# Altium schematic sheet STM32.SchDoc
size A3
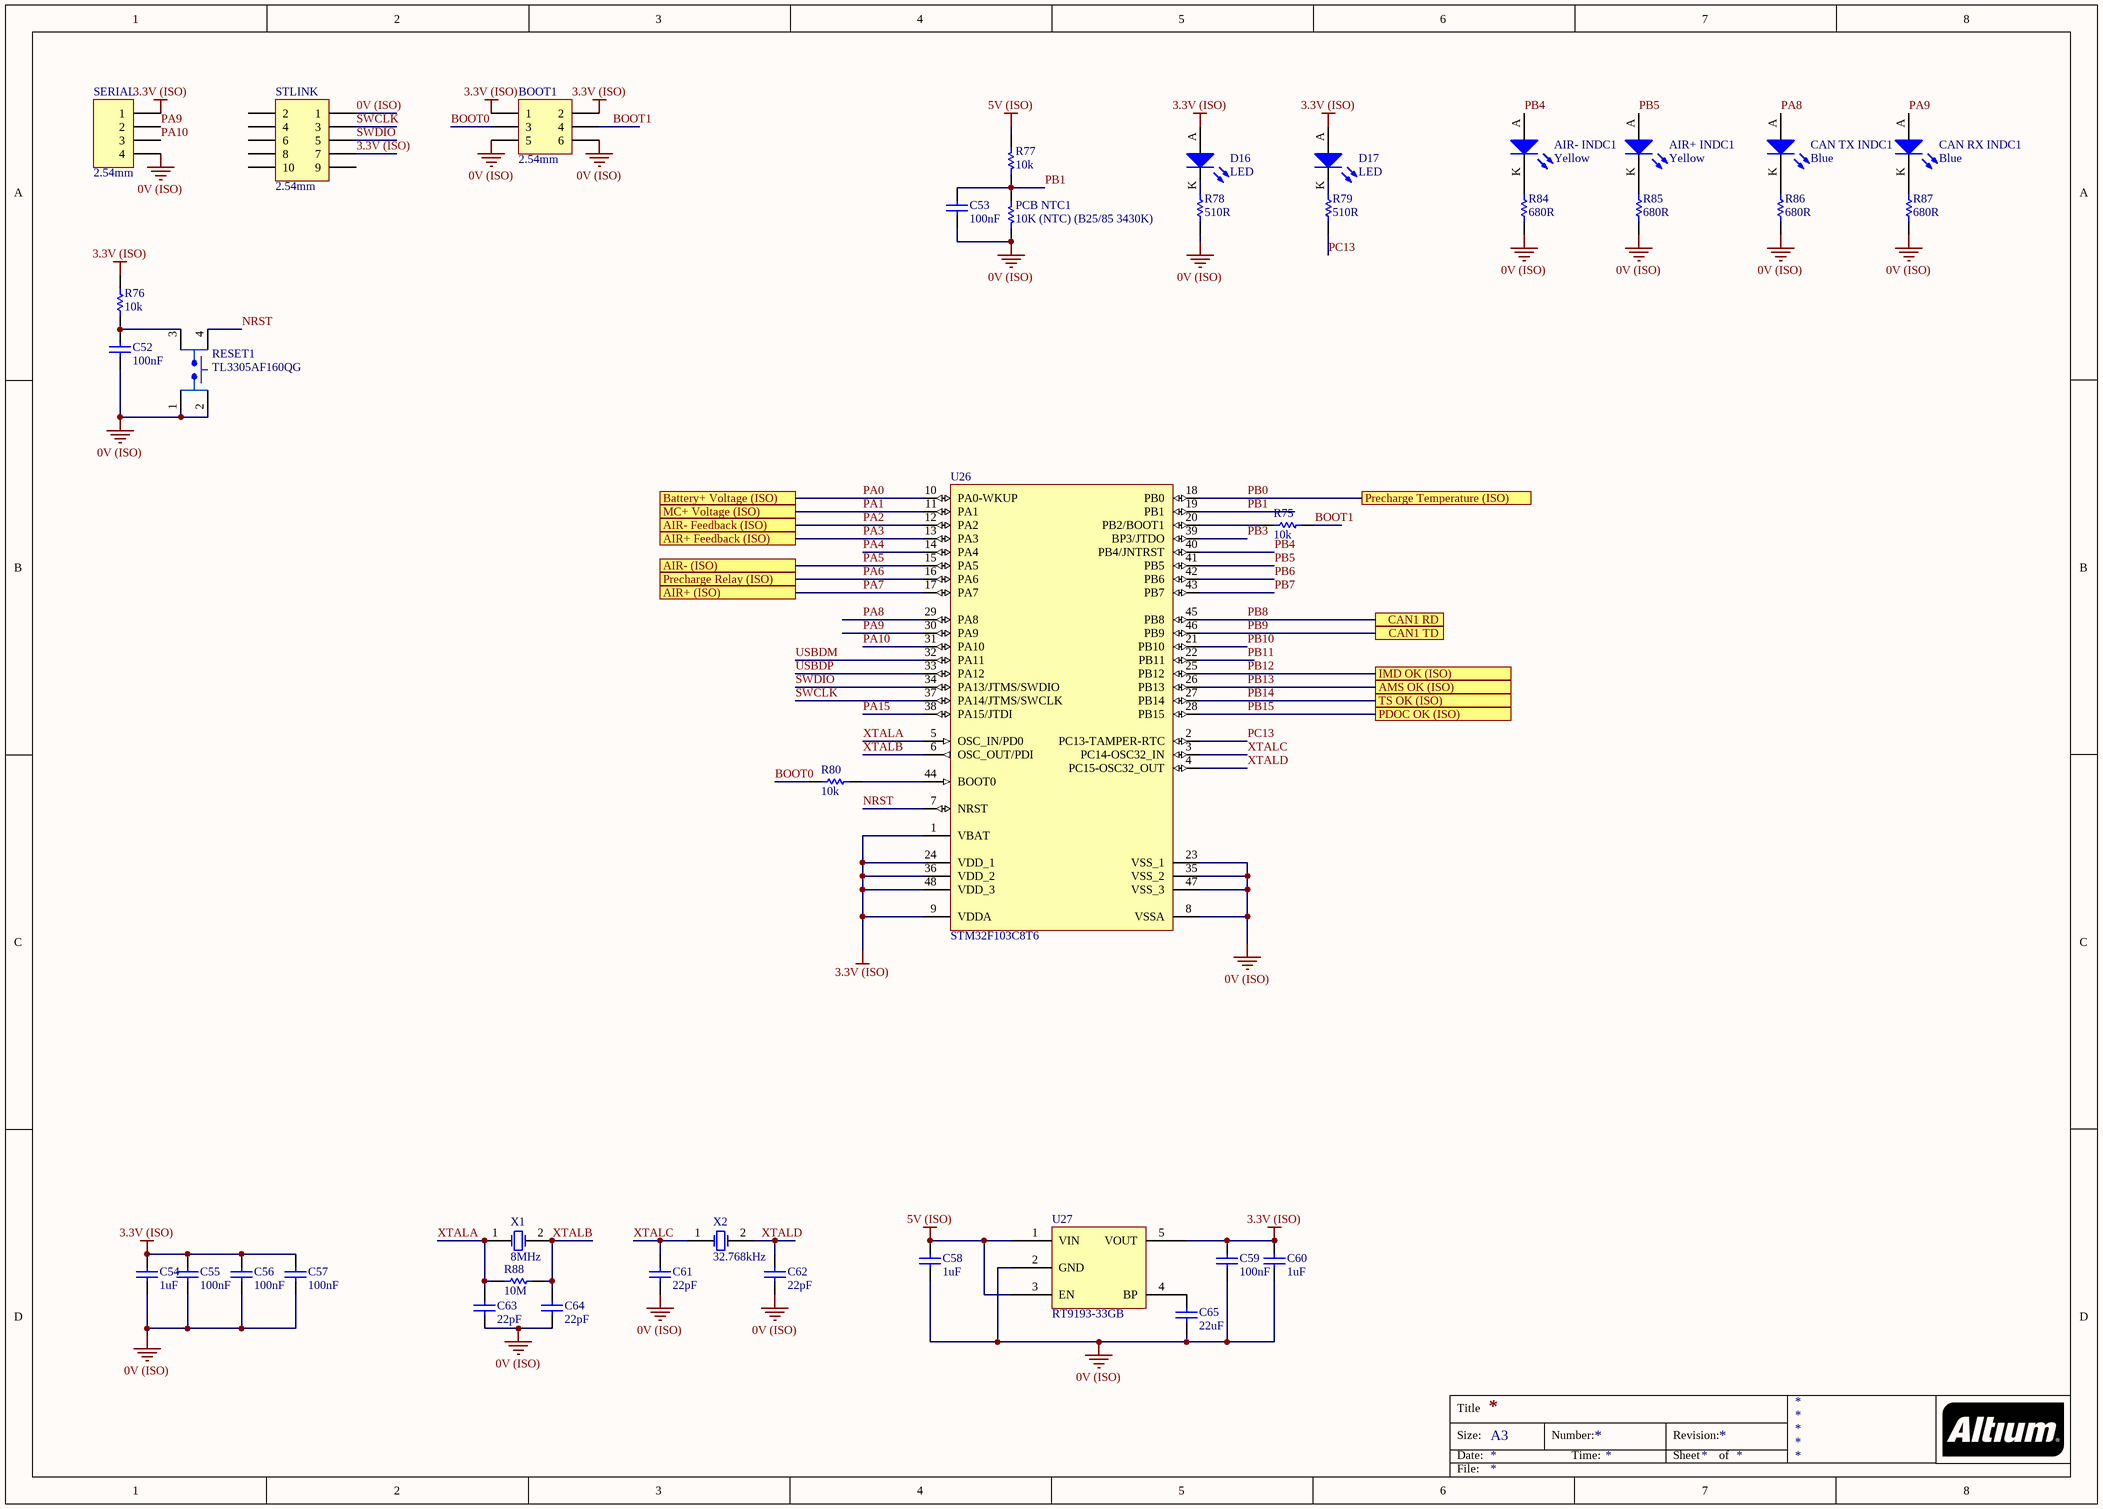
[diagram p0: STM32.SchDoc]

## Parts
AIR+_INDC1  Yellow  [0805 LED]
AIR-_INDC1  Yellow  [0805 LED]
BOOT1  2.54mm  [TH 2.54mm Header 2x3]
C52  100nF  [0805]
C53  100nF  [0805]
C54  1uF  [0805]
C55  100nF  [0805]
C56  100nF  [0805]
C57  100nF  [0805]
C58  1uF  [0805]
C59  100nF  [0805]
C60  1uF  [0805]
C61  22pF  [0805]
C62  22pF  [0805]
C63  22pF  [0805]
C64  22pF  [0805]
C65  22uF  [0805]
CAN_RX_INDC1  Blue  [0805 LED]
CAN_TX_INDC1  Blue  [0805 LED]
D16  LED  [0805 LED]
D17  LED  [0805 LED]
PCB_NTC1  10K (NTC) (B25/85 3430K)  [0805]
R75  10k  [0805]
R76  10k  [0805]
R77  10k  [0805]
R78  510R  [0805]
R79  510R  [0805]
R80  10k  [0805]
R84  680R  [0805]
R85  680R  [0805]
R86  680R  [0805]
R87  680R  [0805]
R88  10M  [0805]
RESET1  TL3305AF160QG  [E-Switch SPST GULL]
SERIAL  2.54mm  [TH 2.54mm Header 1x4]
STLINK  2.54mm  [TH 2.54mm Header 2x5]
U26  STM32F103C8T6  [STM 48-LQFP]
U27  RT9193-33GB  [RICHTEK SOT-23-5]
X1  8MHz  [Abracon HC-49/US]
X2  32.768kHz  [EPSON 2-SMD]

## Ports
AIR+ (ISO), AIR+ Feedback (ISO), AIR- (ISO), AIR- Feedback (ISO), AMS OK (ISO), Battery+ Voltage (ISO), CAN1 RD, CAN1 TD, IMD OK (ISO), MC+ Voltage (ISO), PDOC OK (ISO), Precharge Relay (ISO), Precharge Temperature (ISO), TS OK (ISO)

## Nets
0V (ISO): BOOT1.5 BOOT1.6 C52.1 C53.1 C54.1 C55.1 C56.1 C57.1 C58.1 C59.1 C60.1 C61.1 C62.1 C63.1 C64.1 C65.1 PCB_NTC1.1 R78.1 R84.1 R85.1 R86.1 R87.1 RESET1.1(VDD) RESET1.2(VDD) SERIAL.4 STLINK.1 U26.8(VSSA) U26.23(VSS_1) U26.35(VSS_2) U26.47(VSS_3) U27.2(GND)
3.3V (ISO): BOOT1.1 BOOT1.2 C54.2 C55.2 C56.2 C57.2 C59.2 C60.2 D16.A D17.A R76.2 SERIAL.1 STLINK.7 U26.1(VBAT) U26.9(VDDA) U26.24(VDD_1) U26.36(VDD_2) U26.48(VDD_3) U27.5(VOUT)
5V (ISO): C58.2 R77.2 U27.1(VIN) U27.3(EN)
BOOT0: BOOT1.3 R80.1
BOOT1: BOOT1.4 R75.2
NRST: RESET1.4(VDD) U26.7(NRST)
PA0: U26.10(PA0-WKUP) ; port Battery+ Voltage (ISO)
PA1: U26.11(PA1) ; port MC+ Voltage (ISO)
PA2: U26.12(PA2) ; port AIR- Feedback (ISO)
PA3: U26.13(PA3) ; port AIR+ Feedback (ISO)
PA4: U26.14(PA4)
PA5: U26.15(PA5) ; port AIR- (ISO)
PA6: U26.16(PA6) ; port Precharge Relay (ISO)
PA7: U26.17(PA7) ; port AIR+ (ISO)
PA8: CAN_TX_INDC1.A U26.29(PA8)
PA9: CAN_RX_INDC1.A SERIAL.2 U26.30(PA9)
PA10: SERIAL.3 U26.31(PA10)
PA15: U26.38(PA15/JTDI)
PB0: U26.18(PB0) ; port Precharge Temperature (ISO)
PB1: C53.2 PCB_NTC1.2 R77.1 U26.19(PB1)
PB3: U26.39(BP3/JTDO)
PB4: AIR-_INDC1.A U26.40(PB4/JNTRST)
PB5: AIR+_INDC1.A U26.41(PB5)
PB6: U26.42(PB6)
PB7: U26.43(PB7)
PB8: U26.45(PB8) ; port CAN1 RD
PB9: U26.46(PB9) ; port CAN1 TD
PB10: U26.21(PB10)
PB11: U26.22(PB11)
PB12: U26.25(PB12) ; port IMD OK (ISO)
PB13: U26.26(PB13) ; port AMS OK (ISO)
PB14: U26.27(PB14) ; port TS OK (ISO)
PB15: U26.28(PB15) ; port PDOC OK (ISO)
PC13: R79.1 U26.2(PC13-TAMPER-RTC)
SWCLK: STLINK.3 U26.37(PA14/JTMS/SWCLK)
SWDIO: STLINK.5 U26.34(PA13/JTMS/SWDIO)
USBDM: U26.32(PA11)
USBDP: U26.33(PA12)
XTALA: C63.2 R88.1 U26.5(OSC_IN/PD0) X1.1(OSC1)
XTALB: C64.2 R88.2 U26.6(OSC_OUT/PDI) X1.2(OSC2)
XTALC: C61.2 U26.3(PC14-OSC32_IN) X2.1(OSC1)
XTALD: C62.2 U26.4(PC15-OSC32_OUT) X2.2(OSC2)
NetAIR+_INDC1_K: AIR+_INDC1.K R85.2
NetAIR-_INDC1_K: AIR-_INDC1.K R84.2
NetC52_2: C52.2 R76.1 RESET1.3(VDD)
NetC65_2: C65.2 U27.4(BP)
NetCAN_RX_INDC1_K: CAN_RX_INDC1.K R87.2
NetCAN_TX_INDC1_K: CAN_TX_INDC1.K R86.2
NetD16_K: D16.K R78.2
NetD17_K: D17.K R79.2
NetR75_1: R75.1 U26.20(PB2/BOOT1)
NetR80_2: R80.2 U26.44(BOOT0)

Not connected (* = marked no-connect by the designer): STLINK 2 4 6 8 9 10

## Notes on the sheet
- Title
- Size:
- Date:
- A3
- Number:
- Time:
- Revision:
- Sheet
- of
- File:

## Library data of the parts
AIR+_INDC1 AIR-_INDC1 = SML-211YTT86: Yellow LED Indication - Discrete 1.75V 0805 (2012 Metric); Manufacturer: ROHM Semiconductor; Part Number: SML-211YTT86; Colour: Yellow; Digikey Part Number: 511-1293-1-ND; Digikey Link: https://www.digikey.com/product-detail/en/rohm-semiconductor/SML-211YTT86/511-1293-1-ND/637106
BOOT1 = TH 2.54mm Header 2x3: Positions: 6; Angle: 0; Flange: No; Contact: NA; Part Number: TH 2.54mm Header 2x3; Pitch: 2.54mm; Row Spacing: 2.54mm
C52 C53 C55-C57 C59 = GCM21BR71E104KA37L: Manufacturer: muRata; Tolerance: 10%; Material: X7R; Rated Voltage: 25V; Part Number: GCM21BR71E104KA37L; Value: 100nF
C54 C58 C60 = GCM21BR71A105KA37L: Manufacturer: muRata; Tolerance: 10%; Material: X7R; Rated Voltage: 10V; Part Number: GCM21BR71A105KA37L; Value: 1uF
C61-C64 = GCM21B5C1H220JA37L: Manufacturer: muRata; Tolerance: 5%; Material: C0G; Rated Voltage: 50V; Part Number: GCM21B5C1H220JA37L; Value: 22pF
C65 = GRM21BR61A226ME51L: Manufacturer: muRata; Tolerance: 20%; Material: X5R; Rated Voltage: 10V; Part Number: GRM21BR61A226ME51L; Value: 22uF; Digikey Part Number: 490-10511-1-ND
CAN_RX_INDC1 CAN_TX_INDC1 = SML-MN2BCTT86C: LED BLUE CLEAR 2012 SMD; Manufacturer: ROHM Semiconductor; Part Number: SML-MN2BCTT86C; Colour: Blue; Digikey Part Number: 846-1207-1-ND; Digikey Link: https://www.digikey.com/product-detail/en/rohm-semiconductor/SMLMN2BCTT86C/846-1207-1-ND/6057239
D16 D17 = LED: Red LED Indication - Discrete 1.75V 0805 (2012 Metric); Manufacturer: ROHM Semiconductor; Part Number: SML-210LTT86; Colour: Red; Digikey Part Number: 511-1286-1-ND; Digikey Link: https://www.digikey.com/product-detail/en/rohm-semiconductor/SML-210LTT86/511-1286-1-ND/637099
PCB_NTC1 = NTCS0805E3103FLT: Manufacturer: Vishay Beyschlag; Tolerance: 0.01; Rated Voltage: 210mW; Part Number: NTCS0805E3103FLT; Value: 10K (NTC) (B25/85 3430K); Digikey Part Number: BC2733CT-ND
R75-R77 R80 = RC0805FR0710KL: Manufacturer: YAGEO; Tolerance: 0.01; Rated Voltage: 0.125W; Part Number: RC0805FR0710KL; Value: 10k; Material: FR-07
  R75: qty: 50
R78 R79 = RC0805FR07510RL: Manufacturer: YAGEO; Tolerance: 0.01; Rated Voltage: 0.125W; Part Number: RC0805FR07510RL; Value: 510R; Material: FR-07
R84-R87 = RC0805FR07680RL: Manufacturer: YAGEO; Tolerance: 0.01; Rated Voltage: 0.125W; Part Number: RC0805FR07680RL; Value: 680R; Material: FR-07
R88 = RC0805FR0710ML: Manufacturer: YAGEO; Tolerance: 0.01; Rated Voltage: 0.125W; Part Number: RC0805FR0710ML; Value: 10M; Material: FR-07
RESET1 = TL3305AF160QG: Tactile Switch SPST-NO Top Actuated Surface Mount; Manufacturer: E-Switch; Part Number: TL3305AF160QG; Digikey Part Number: EG5350TR-ND; Digikey Link: https://www.digikey.com/product-detail/en/e-switch/TL3305AF160QG/EG5350TR-ND/5816181
SERIAL = TH 2.54mm Header 1x4: Positions: 4; Angle: 0; Flange: No; Contact: NA; Part Number: TH 2.54mm Header 1x4; Pitch: 2.54mm; Row Spacing: 2.54mm
STLINK = TH 2.54mm Header 2x5: Positions: 10; Angle: 0; Flange: No; Contact: NA; Part Number: TH 2.54mm Header 2x5; Pitch: 2.54mm; Row Spacing: 2.54mm
U26 = STM32F103C8T6: ARM® Cortex®-M3 STM32F1 Microcontroller IC 32-Bit 72MHz 64KB (64K x 8) FLASH; Manufacturer: STMicroelectronics; Part Number: STM32F103C8T6; Digikey Part Number: 497-6063-ND; Digikey Link: https://www.digikey.com/product-detail/en/stmicroelectronics/STM32F103C8T6/497-6063-ND/1646338
U27 = RT9193-33GB: IC REG LINEAR 3.3V 300MA SOT23-5; Manufacturer: Richtek; Part Number: RT9193-33GB; Digikey Part Number: 1028-1014-1-ND; Digikey Link: https://www.digikey.com/products/en?keywords=1028-1014-1-ND
X1 = ABLS-8.000MHZ-B4-T: Manufacturer: Abracon LLC; Load Capacitance: 18pF; ESR: 80R; Part Number: ABLS-8.000MHZ-B4-T; Value: 8MHz; Digikey Part Number: 535-10212-2-ND; Digikey Link: https://www.digikey.com/product-detail/en/abracon-llc/ABLS-8.000MHZ-B4-T/535-10212-2-ND/2184155
X2 = FC-135 32.7680KA-A5: Manufacturer: EPSON; Load Capacitance: 12.5pF; ESR: 70k; Part Number: FC-135 32.7680KA-A5; Value: 32.768kHz; Digikey Part Number: SER4103TR-ND; Digikey Link: https://www.digikey.com/product-detail/en/epson/FC-135-32.7680KA-A5/SER4103TR-ND/5259895